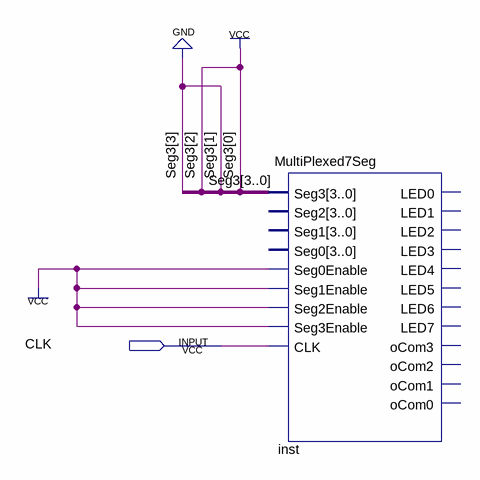
[diagram p0: schematic sheet]
// Quartus schematic Test1.bdf as structural Verilog: 1 symbols, 1 pins
module Test1 (
  input  CLK
);

  MultiPlexed7Seg inst (
    .Seg3(4'b0101), .Seg0Enable(1'b1), .Seg1Enable(1'b1), .Seg2Enable(1'b1), .Seg3Enable(1'b1), .CLK(CLK));  // open: Seg2, Seg1, Seg0, LED0, LED1, LED2, LED3, LED4, LED5, LED6, LED7, oCom3, oCom2, oCom1, oCom0
endmodule
